# Altium schematic sheet ADS1299.SchDoc
size A; SheetNumber: 1; SheetTotal: 1
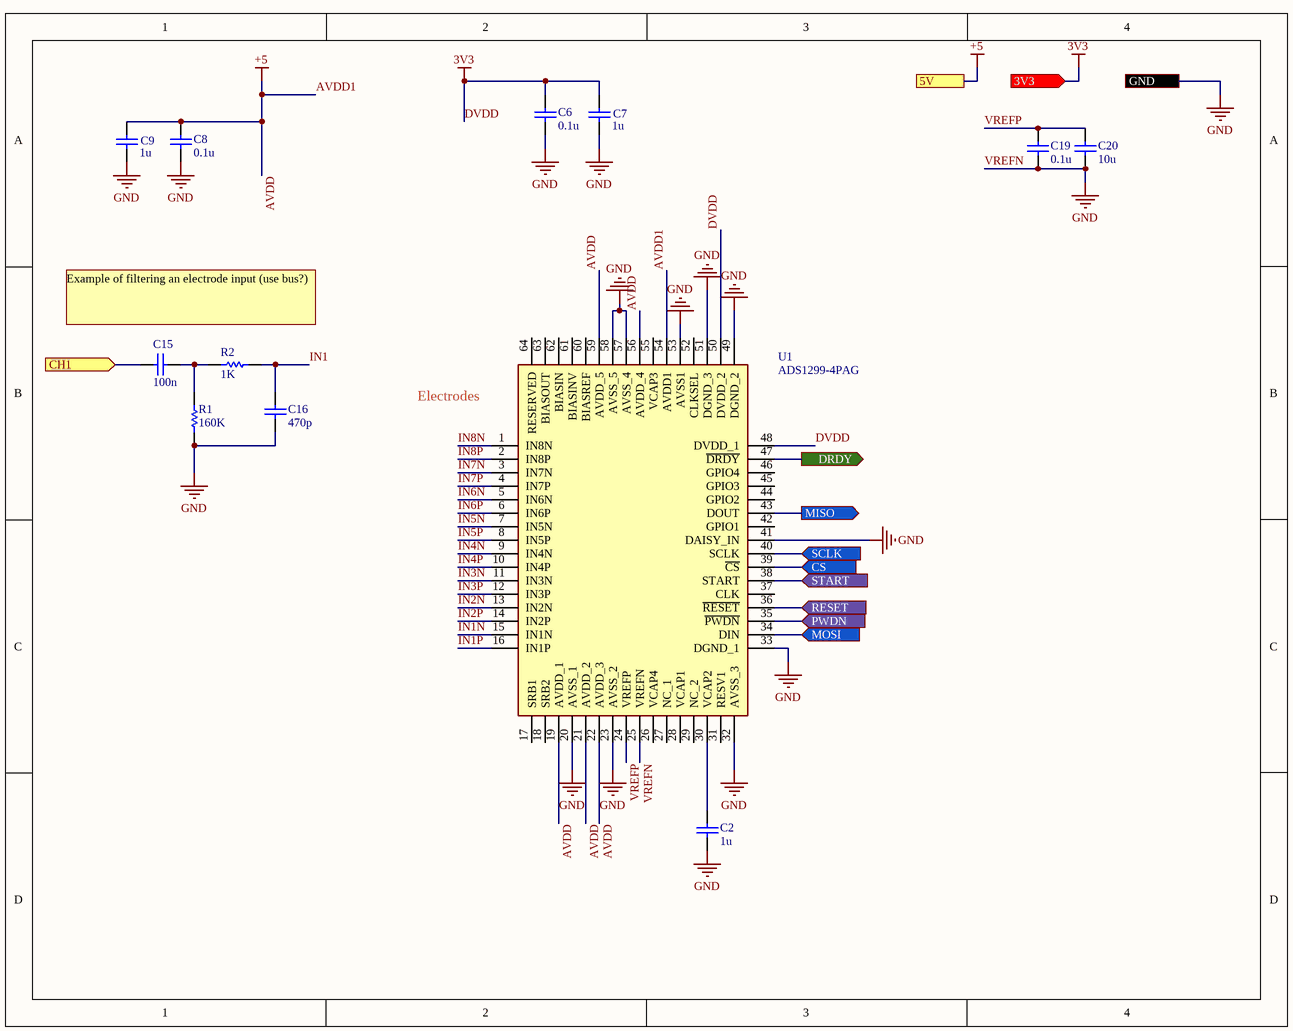
[diagram p0: ADS1299.SchDoc]

## Parts
C2  value 1u  (hidden comment: Capacitor)
C6  value 0.1u  (hidden comment: Capacitor)
C7  value 1u  (hidden comment: Capacitor)
C8  value 0.1u  (hidden comment: Capacitor)
C9  value 1u  (hidden comment: Capacitor)
C15  value 100n  (hidden comment: Capacitor)
C16  value 470p  (hidden comment: Capacitor)
C19  value 0.1u  (hidden comment: Capacitor)
C20  value 10u  (hidden comment: Capacitor)
R1  value 160K  (hidden comment: Resistor)
R2  value 1K  (hidden comment: Resistor)
U1  ADS1299-4PAG  [QFP50P1200X1200X120-64N]

## Ports
3V3 (in), 5V, CH1 (in), CS (in), DRDY (out), GND, MISO (out), MOSI (in), PWDN (in), RESET (in), SCLK (in), START (in)

## Nets
AVDD: C8.2 C9.2 U1.19(AVDD_1) U1.21(AVDD_2) U1.22(AVDD_3) U1.54(AVDD1) U1.56(AVDD_4) U1.59(AVDD_5) ; port 5V  [also labelled +5, AVDD1]
DVDD: C6.2 C7.2 U1.48(DVDD_1) U1.50(DVDD_2) ; port 3V3  [also labelled 3V3]
VREFN: C2.2 C6.1 C7.1 C8.1 C9.1 C16.1 C19.1 C20.1 R1.1 U1.20(AVSS_1) U1.23(AVSS_2) U1.25(VREFN) U1.32(AVSS_3) U1.33(DGND_1) U1.41(DAISY_IN) U1.49(DGND_2) U1.51(DGND_3) U1.53(AVSS1) U1.57(AVSS_4) U1.58(AVSS_5) ; port GND  [also labelled GND]
CH1: C15.2 ; port CH1
CS: U1.39(~{CS}) ; port CS
DRDY: U1.47(~{DRDY}) ; port DRDY
IN1: C16.2 R2.2
IN1N: U1.15(IN1N)
IN1P: U1.16(IN1P)
IN2N: U1.13(IN2N)
IN2P: U1.14(IN2P)
IN3N: U1.11(IN3N)
IN3P: U1.12(IN3P)
IN4N: U1.9(IN4N)
IN4P: U1.10(IN4P)
IN5N: U1.7(IN5N)
IN5P: U1.8(IN5P)
IN6N: U1.5(IN6N)
IN6P: U1.6(IN6P)
IN7N: U1.3(IN7N)
IN7P: U1.4(IN7P)
IN8N: U1.1(IN8N)
IN8P: U1.2(IN8P)
MISO: U1.43(DOUT) ; port MISO
MOSI: U1.34(DIN) ; port MOSI
PWDN: U1.35(~{PWDN}) ; port PWDN
RESET: U1.36(~{RESET}) ; port RESET
SCLK: U1.40(SCLK) ; port SCLK
START: U1.38(START) ; port START
VREFP: C19.2 C20.2 U1.24(VREFP)
NetC2_1: C2.1 U1.30(VCAP2)
NetC15_1: C15.1 R1.2 R2.1

Not connected (* = marked no-connect by the designer): U1 17(SRB1) 18(SRB2) 26(VCAP4) 27(NC_1) 28(VCAP1) 29(NC_2) 31(RESV1) 37(CLK) 42(GPIO1) 44(GPIO2) 45(GPIO3) 46(GPIO4) 52(CLKSEL) 55(VCAP3) 60(BIASREF) 61(BIASINV) 62(BIASIN) 63(BIASOUT) 64(RESERVED)

## Notes on the sheet
- Example of filtering an electrode input (use bus?)
- (near U1) Electrodes

## Library data of the parts
C2 C6-C9 C15 C16 C19 C20 = Capacitor: SimulationGenericComponent: True
R1 R2 = Resistor: TC1: 0; SimulationGenericComponent: True; TC2: 0
U1 = ADS1299-4PAG: Low-Noise, 4-Channel, 24-Bit Analog-to-Digital Converter for Biopotential Measurements; Manufacturer_Name: Texas Instruments; Geometry.Height: 1.2mm; Mouser Part Number: 595-ADS1299-4PAG; Mouser Price/Stock: https://www.mouser.co.uk/ProductDetail/Texas-Instruments/ADS1299-4PAG?qs=9lcNTSmDlCovTG3JfbaYgg%3D%3D; Manufacturer_Part_Number: ADS1299-4PAG; Datasheet Link: http://www.ti.com/lit/gpn/ads1299-4